# Altium project Buck_Boost Converter.PrjPcb
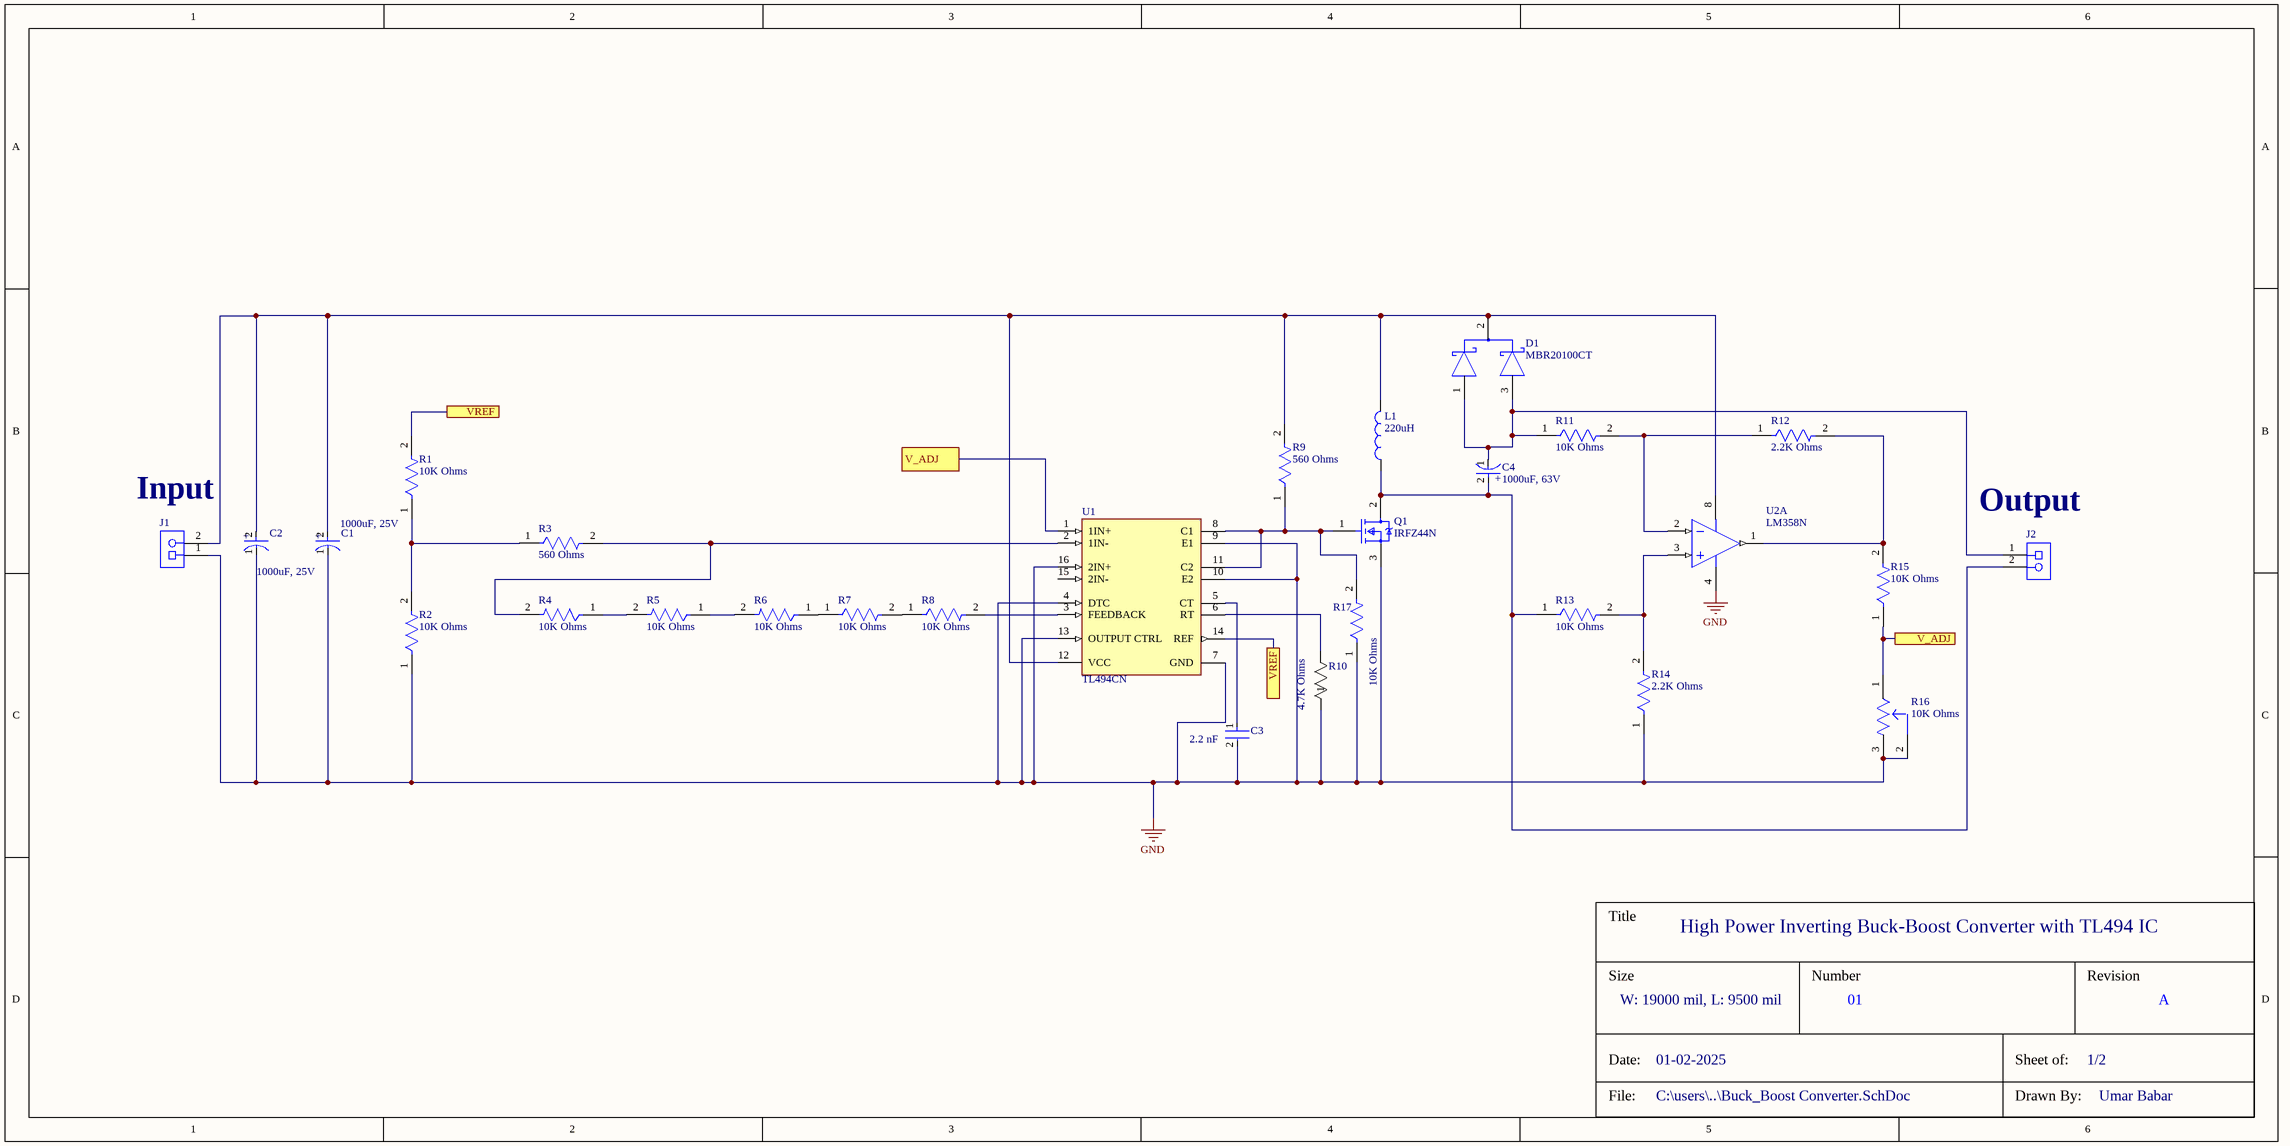
[diagram p0: Buck_Boost Converter.SchDoc]
1 sheet, 28 parts. Net scope: flat (ports and power ports of the same name join across sheets).
Board file: Buck_Boost Converter.PcbDoc

## Sheet Buck_Boost Converter.SchDoc
size 482 x 241 mm; SheetNumber: 1; SheetTotal: 1

### Parts
C1  1000uF, 25V  [FP-RAD-TH-D_12_5_0_5-L_20-MFG]
C2  1000uF, 25V  [FP-RAD-TH-D_12_5_0_5-L_20-MFG]
C3  2.2 nF  [FP-VY1470-MFG]
C4  1000uF, 63V  [FP-RAD-TH-D_16_0_5-L_25_2-MFG]
D1  MBR20100CT  [FP-MBR20100CT-E3-4W-MFG]
J1  1729128  [PHOE-1729128-2_V]  (value not drawn)
J2  1729128  [PHOE-1729128-2_V]  (value not drawn)
L1  220uH  [744115]
Q1  IRFZ44N  [FP-PG-TO262-3-MFG]
R1  10K Ohms  [FP-MBB0207-MFG]
R2  10K Ohms  [FP-MBB0207-MFG]
R3  560 Ohms  [FP-PAC03-MFG]
R4  10K Ohms  [FP-MBB0207-MFG]
R5  10K Ohms  [FP-MBB0207-MFG]
R6  10K Ohms  [FP-MBB0207-MFG]
R7  10K Ohms  [FP-MBB0207-MFG]
R8  10K Ohms  [FP-MBB0207-MFG]
R9  560 Ohms  [FP-PAC03-MFG]
R10  4.7K Ohms  [RES_AC05_VIS]
R11  10K Ohms  [FP-MBB0207-MFG]
R12  2.2K Ohms  [FP-CFR50J2K2-MFG]
R13  10K Ohms  [FP-MBB0207-MFG]
R14  2.2K Ohms  [FP-CFR50J2K2-MFG]
R15  10K Ohms  [FP-MBB0207-MFG]
R16  10K Ohms  [FP-3266W-MFG]
R17  10K Ohms  [FP-MBB0207-MFG]
U1  TL494CN  [N0016A]
U2  LM358N  [ONSC-PDIP-8-626-05_M]  (part A of 2)

### Ports
V_ADJ (see Buck_Boost Converter[3B]), V_ADJ (see Buck_Boost Converter[5C]), VREF (see Buck_Boost Converter[2B]), VREF (see Buck_Boost Converter[4C])

### Nets
GND: C1.1(C) C2.1(C) C3.2 J1.1 Q1.3(S) R2.1 R10.1 R14.1 R16.2(WIPER) R16.3(CW) R17.1 U1.4(DTC) U1.7(GND) U1.9(E1) U1.10(E2) U1.13(OUTPUT_CTRL) U1.16(2IN+) U2.4(VEE/GND)
NetC1_2: C1.2(A) C2.2(A) D1.2(COMMON_CATHODE) J1.2 L1.2 R9.2 U1.12(VCC) U2.8(VCC)
NetC3_1: C3.1 U1.5(CT)
NetC4_1: C4.1(C) D1.1(1_ANODE) D1.3(2_ANODE) J2.1 R11.1
NetC4_2: C4.2(A) J2.2 L1.1 Q1.2(D) R13.1
NetQ1_1: Q1.1(G) R9.1 R17.2 U1.8(C1) U1.11(C2)
NetR1_1: R1.1 R2.2 R3.1
NetR1_2: R1.2 U1.14(REF) ; port VREF
NetR3_2: R3.2 R4.2 U1.2(1IN-)
NetR4_1: R4.1 R5.2
NetR5_1: R5.1 R6.2
NetR6_1: R6.1 R7.1
NetR7_2: R7.2 R8.1
NetR8_2: R8.2 U1.3(FEEDBACK)
NetR10_2: R10.2 U1.6(RT)
NetR11_2: R11.2 R12.1 U2.2(INA-)
NetR12_2: R12.2 R15.2 U2.1(OUTA)
NetR13_2: R13.2 R14.2 U2.3(INA+)
NetR15_1: R15.1 R16.1(CCW) U1.1(1IN+) ; port V_ADJ

Not connected (* = marked no-connect by the designer): U1 15(2IN-)

### Notes on the sheet
- Input
- (near J2) Output
- Title
- Size
- High Power Inverting Buck-Boost Converter with TL494 IC
- Number
- Revision
- W: 19000 mil, L: 9500 mil
- 01
- A
- Date:
- File:
- 01-02-2025
- C:\users\..\Buck_Boost Converter.SchDoc
- Sheet of:
- Drawn By:
- 1/2
- Umar Babar
- (in symbol CMP-05427-000606-1) +
- (in symbol CMP-05427-000837-1) +

### Library data of the parts
C1 C2 = CMP-05427-000606-1: Aluminum Electrolytic Capacitors (Radial Lead Type) 1000uF ±20% 25V; Lead Length: 17mm; ESR (Equivalent Series Resistance): 18mR; Dissipation Factor: 0.14%; Lead Diameter: 0.6mm; Dielectric Material: Aluminium; Capacitance: 1mF; Life (Hours): 5000Hour; Ripple Current: 2.6A; Contact Plating: Tin; Voltage: 25V; Length: 20mm; Packaging: Bulk; RoHS Compliant: Yes; REACH SVHC: Yes; Lead Free: Lead Free; Tolerance: 20%; Features: General Purpose; Construction: RADIAL; Lead Pitch: 5mm; Impedance: 18mR; Min Operating Temperature: -40°C; Case/Package: Radial; Diameter: 12.5mm; Height - Seated (Max): 0.787inch; Package Quantity: 200; Mount: Through Hole; Max Operating Temperature: 105°C; Series: FM; Height: 20mm; Voltage Rating (DC): 25V; Termination: Radial; Voltage Rating: 25V; Radiation Hardening: No
C3 = CMP-02417-000069-1: CAP CER 2200PF 760VAC Y5U RADIAL; Capacitance: 2.2nF; Lead Diameter: 0.6mm; Ratings: X1; Voltage Rating (AC): 500V; Lead/Base Style: Kinked; Tolerance: 20%; Max Operating Temperature: 125°C; Resistor Type: Ceramic; Contact Plating: Tin; Thickness: 5mm; Width: 5mm; Min Operating Temperature: -40°C; Depth: 5mm; Mount: Through Hole; Termination: Radial; Lead Free: Lead Free; Diameter: 12mm; Height: 15mm; Radiation Hardening: No; Lead Pitch: 10mm; Case/Package: Radial; RoHS Compliant: Yes; Series: VY1; Dielectric: Y5U; Construction: RADIAL; Voltage: 500V; Voltage Rating (DC): 500V; Packaging: Tape and Reel; Height - Seated (Max): 0.63inch; Package Quantity: 500
C4 = CMP-05427-000837-1: Aluminum Electrolytic Capacitors (Radial Lead Type) AEC-Q200 Qualified 1000uF ±20% 63V; Lead Diameter: 0.8mm; Life (Hours): 2000Hour; Lead/Base Style: Straight; Capacitance: 1mF; Ripple Current: 930mA; Series: NHG; Diameter: 16mm; Tolerance: 20%; Max Operating Temperature: 105°C; Packaging: Tape and Reel; Min Operating Temperature: -55°C; Lead Pitch: 7.5mm; Mount: Through Hole; RoHS Compliant: Yes; Radiation Hardening: No; Contact Plating: Tin; Length: 25mm; Height - Seated (Max): 1.063inch; Voltage Rating: 63V; Voltage Rating (DC): 63V; Case/Package: Radial; Height: 25mm; Termination: Radial; Package Quantity: 250
D1 = CMP-00030-42878425-1: MBR20100CT-E3/4W Dual Common-Cathode High-Voltage Schottky Rectifier; Forward Voltage: 800mV; Max Junction Temperature (Tj): 150°C; Forward Current: 20A; Max Reverse Voltage (DC): 100V; Max Surge Current: 150A; Max Reverse Leakage Current: 100µA; Average Rectified Current: 10A; Element Configuration: Common Cathode; Length: 10.5156mm; Schedule B: 8541100080, 8541100080; Case/Package: TO-220AB; NexarPartId: 42878425; Number of Pins: 3; Min Operating Temperature: -65°C; Reverse Voltage: 100V; Height: 15.3162mm; Peak Non-Repetitive Surge Current: 150A; RoHS: Compliant; Max Operating Temperature: 150°C; Radiation Hardening: No; Lead Free: Lead Free; Mount: Through Hole; Max Repetitive Reverse Voltage (Vrrm): 100V; Max Forward Surge Current (Ifsm): 150A; Width: 4.699mm; Peak Reverse Current: 100µA
J1 J2 = CMP-2000-05815-1: PCB Terminal Block, 13.5 A, 400 V, 2-Pin THD, RoHS, Bulk; Manufacturer: Phoenix Contact; Package Version: 03/2015; No. of Rows: 1; Pitch: 5.08mm; No. of Positions: 2; Voltage Rating: 400V; Current Rating: 13500mA; Manufacturer URL: http://www.phoenixcontact.com/; Datasheet URL: https://datasheet.ciiva.com/16046/1729128-16046181.pdf; RoHS: TRUE; Package URL: https://www.phoenixcontact.com/online/portal/pi/pxc/product_detail_page/!ut/p/b1/3VdJjqNKFDxLH8AFycySyWY2ozFsEPOMMQaDOX1XedGL_1Vdm5YXJleknhSKeBkvI6EA8ncAo3AYoDhBQGco6KN7VURTdemj9us_IEKEZo_YHiPAEWEFmDGOHMORkqKYCORBZxgL7ZoaZYcbFFUZ3fqxSY6GOuxydWUuHqz1ynmMFygu583Bob0Ewr6Sd_l-5m-kAueHiB0jpRwZwe58wwtkpxtMYd_LmGcDRU02dRNEyWt6Y2ti5pSyJ_reIkzIulrqApdnbT11V5jnCKbYNCvhEM1MCpPByat_X379-iThf08CI5GfOPqfBeS3BRoBOdD55AKVv0iLwCMq-2BrzXWSGRH7pUGD9uwXQjiph3xL0DKQwdGa0JImiIOmBNOestqgwTHSSs2oOep-78apyXQBvNi8ZLaFjvjWvcaUEBu0MC6Wbe-d6mB0FAebo2lUWinqYaZs5DAYzV0RP9yitUjnGJ0iI9xhZkT42OCQNUJJhkgWINNQLP2JFP6OpMg3JCVg70jqHT0lvKOnhHf0lPuOnnLf0VPuWx6_dxwUIvwk5WMkT0kLL1mh61l2yZVSzG3pYV_bqo-mj6uMKwKwdnnW8Jh5RTOJzMOA5c-eJDaZQw4mTMPH02PvS_ZAqNVjVTo2WyYLkwH_KU1mmmG5kjRhDqPXLwwVHvVOjCM60-fpXvTDfMGW1PVFVS1r4e4yVDk4ZdNbkUHvqPqQSeian4UD39fNKmachqdJ1NJbyk8rXT9mXTvPk3oE5meulKGgiruPJek-4I9hTT6G8ZLOyRSm2RRVbThERQad5OS28hdt4YW4vG0stgYYzsWsK4_7y6DZMjJSCqri1kyiZR5vD7pwIrNR7QwPHTcLTI5qT7eRlpHrdGiupYlqQDJ7zy_CND8fWWBoLRXxk1RVcXiBQwbTD4Xi7KL-FuO94t9xaqweXzH; PartNumber: 1729128; Package Description: 2-Pin Through Hole Device, Body 8.1 x 10.16 mm, Pitch 5.08 mm; Datasheet Version: 12/2013; Mounting Technology: ThroughHole; Orientation: Horizontal; Package Reference: 1729128-2; Packing: Bulk
L1 = CMP-03913-22803288-1: 744115 200 µH ±20% Ferrite Toroidal Inductor, 2.2A Idc, 180mO Rdc WE-SI; DC Resistance (DCR): 180mΩ; Max DC Current: 1A; Saturation Current: 900mA; Pin Length: 20mm; Test Frequency: 10kHz; Inductance: 200µH; Shielding: Unshielded; Self Resonant Frequency: 3MHz; Pitch: 500µm; RoHS: Compliant; Ambient Temperature Range High: 65°C; Case/Package: Radial; Ambient Temperature Range Low: -40°C; Lead Pitch: 7.5mm; Diameter: 18mm; Height: 20mm; Min Operating Temperature: -40°C; Current Rating: 2.2A; Width: 9.7mm; Length: 18mm; Depth: 9mm; NexarPartId: 22803288; Mount: Through Hole, Wire; Packaging: Bulk; Max Operating Temperature: 105°C; Core Material: Ferrite; Tolerance: 20%
Q1 = CMP-00196-65874408-1: IRFZ44NLPBF Single N-Channel 55 V 17.5 mOhm 63 nC HEXFET® Power Mosfet - TO-262; Resistance: 17.5MΩ; Turn-On Delay Time: 12ns; Drain to Source Breakdown Voltage: 55V; Threshold Voltage: 4V; Rise Time: 60ns; Input Capacitance: 1.47nF; Power Dissipation: 110W; Max Junction Temperature (Tj): 175°C; Gate to Source Voltage (Vgs): 20V; Number of Channels: 1; Fall Time: 45ns; Max Power Dissipation: 3.8W; Continuous Drain Current (ID): 49A; Turn-Off Delay Time: 44ns; Case/Package: TO-262; Lifecycle Status: Production; Packaging: Bulk; RoHS: Compliant; Radiation Hardening: No; Height: 9.65mm; Voltage Rating (DC): 55V; On-State Resistance: 17.5mΩ; Width: 4.826mm; Mount: Through Hole; Max Operating Temperature: 175°C; Schedule B: 8541290080, 8541290080; Termination: Through Hole; Dual Supply Voltage: 55V; Package Quantity: 1000; Min Operating Temperature: -55°C; Lead Free: Contains Lead, Lead Free; Drain to Source Voltage (Vdss): 55V; Element Configuration: Single; Length: 10.668mm; Rds On Max: 17.5mΩ; Number of Pins: 3; Current Rating: 49A; REACH SVHC: No SVHC; Drain to Source Resistance: 17.5mΩ; NexarPartId: 65874408; Number of Elements: 1; Nominal Vgs: 4V
R1 R2 R4-R8 R11 R13 R15 R17 = CMP-02408-000035-1: RES 10K OHM 0.6W 1% AXIAL; Voltage Rating: 300V; Resistance: 10kR; Max Power Dissipation: 600mW; Temperature Coefficient: 50ppm/°C; Radiation Hardening: No; Case/Package: Conformal; Termination: Axial; Military Standard: Not; Length: 6.5mm; Voltage Rating (DC): 300V; RoHS Compliant: Yes; Number of Terminations: 2; Packaging: Tape and Reel; Features: Automotive AEC-Q200; Tolerance: 1%; Min Operating Temperature: -55°C; Power Rating: 600mW; Lead Free: Lead Free; Resistor Type: Metal Film; Construction: Cylindrical; Series: MBB 0207 - Professional; Max Operating Temperature: 155°C; Diameter: 2.5mm; Resistance Tolerance: 1%; Contact Plating: Tin; Technology: THIN FILM
R3 R9 = CMP-02408-000023-1: RES 560 OHM 3W 1% AXIAL; Temperature Coefficient: 100ppm/°C; Resistance: 560R; Case/Package: Axial; Contact Plating: Tin; Power Rating: 3W; Max Operating Temperature: 275°C; RoHS Compliant: Yes; Max Power Dissipation: 3W; Series: PAC; Packaging: Cut Tape; Diameter: 5.5mm; Resistor Type: Wirewound; Features: Flame Retardant Coating; Mount: Through Hole; Length: 0.65inch; Package Quantity: 1; Number of Terminations: 2; Radiation Hardening: No; Min Operating Temperature: -55°C; Tolerance: 1%
R10 = CMP-00030-39747417-1: AC05000004701JAC00 VISHAY AC05000004701JAC00 Through Hole Resistor, AC Series, 4.7 kohm, 5 W, 5%, Axial Leaded; Voltage Rating: 153V; Lead Diameter: 800µm; Max Power Dissipation: 5W; Resistance: 4.7kΩ; Temperature Coefficient: 180ppm/°C; Schedule B: 8533210080, 8533210080; REACH SVHC: Unknown; Voltage Rating (DC): 153V; NexarPartId: 39747417; RoHS: Compliant; Tolerance: 5%; Features: Flame Retardant Coating; Case/Package: Conformal; Diameter: 7.5mm; Number of Pins: 2; Number of Terminations: 2; Length: 18mm; Max Operating Temperature: 275°C; Lead Free: Lead Free; Termination: Axial; Packaging: Tape & Box (TB); Contact Plating: Tin; Radiation Hardening: No; Military Standard: Not; Min Operating Temperature: -40°C; Composition: Wirewound; Power Rating: 5W; Width: 7.49mm
R12 R14 = CMP-03212-000011-1: RES 2.2K OHM 5% 1/2W AXIAL; Temperature Coefficient: 0ppm/°C; Max Power Dissipation: 500mW; Resistance: 2.2kR; Number of Resistors: 1; Voltage Rating (DC): 350V; Case/Package: Axial; Number of Terminations: 2; REACH SVHC: No SVHC; Mount: Axial; Packaging: Cut Tape; Min Operating Temperature: -55°C; Series: CFR50, Neohm; Resistor Type: Thin Film; Tolerance: 5%; Radiation Hardening: No; Package Quantity: 3000; Power Rating: 500mW; Length: 9mm; Termination: Axial; Max Operating Temperature: 155°C; ELV: Compliant; Voltage Rating: 350V; Resistance Tolerance: 5%; Technology: CARBON FILM; Diameter: 3mm; RoHS Compliant: Yes
R16 = CMP-07234-000016-1: TRIMMER 10K OHM 0.25W PC PIN TOP; Manufacturer: Bourns; Manufacturer Part Number: 3266W-1-103LF; Temperature Coefficient: 100ppm/°C; Tolerance: 10%; Value: 10kΩ; Standoff Height: 0.43mm; Device Class L3: Variable Resistors and Potentiometers; ComponentLink2URL: https://www.bourns.com/docs/Product-Datasheets/3266.pdf; ComponentLink2Description: Datasheet; Device Class L2: Resistors; Power Rating: 0.25W; Mouser Description: Trimmer Resistors - Through Hole 1/4 10Kohms 10% SQ W/Standoff Sealed; Category: Res; Digikey Description: TRIMMER 10K OHM 0.25W PC PIN TOP; Device Class L1: Passive Components; Octopart: https://octopart.com/3266w-1-103lf-bourns-81445; Height: 9.02mm; Temperature Range High: +125°C; Series: 3266; Temperature Range Low: -55°C; Composition: Cermet; Resistance: 10kΩ; Lead Free: Yes; RoHS: TRUE; Automotive: No; Package: 3266W; Temperature: -55°C to +125°C
U1 = CMP-0319-00147-2: Pulse-Width-Modulation Control Circuit with Voltage Control, 45 % Duty Cycle, 0 to +70 degC, 16-pin PDIP (N), Pb-Free (RoHS); Manufacturer: Texas Instruments; Regulated Outputs(#): 2; Rating: Military; SubFamily: PWM Controller; Frequency(Max)(kHz): 300; Topology: Boost, Buck, Flyback, Forward, Full-Bridge, Half-Bridge, Push-Pull; Duty Cycle(Max)(%): 45; Eco-Plan: Pb-Free (RoHS); Control Method: Voltage; Mounting Technology: Through Hole; PackageDescription: 16-Pin Plastic Dual-In-Line Package, Row Spacing 7.62 mm, Pitch 2.54 mm; Code_JEDEC: MS-001*; PackageVersion: revE, Dec-2002; PartNumber: TL494CN; ComponentLink1URL: http://www.ti.com/general/docs/lit/getliterature.tsp?genericPartNumber=TL494&fileType=pdf; ComponentLink1Description: Datasheet; PackageReference: N0016A; DatasheetVersion: SLVS074E
U2 = CMP-1310-00098-1: Single Supply Dual Operational Amplifier, 3 to 32 V, 0 to 70 degC, 8-Pin PDIP, Tube; Manufacturer: On Semiconductor; VCC Max (V): 32; VCC Min (V): 3; Mounting Technology: Through Hole; ComponentLink3Description: Package Specification; ComponentLink3URL: http://www.onsemi.com/pub_link/Collateral/LM211-D.PDF; RoHS: FALSE; Packing: Tube; PackageDescription: 8-Pin Plastic Dual-In Line Package, Body 9.52 x 6.605 mm, Pitch 2.54 mm; PackageReference: PDIP-8-626-05; PackageVersion: Rev. M, 04/2010; PartNumber: LM358N; ComponentLink2Description: Datasheet; ComponentLink2URL: http://www.onsemi.cn/pub_link/Collateral/LM358-D.PDF; ComponentLink1URL: http://www.onsemi.com/; ComponentLink1Description: Manufacturer URL; DatasheetVersion: Rev. 27